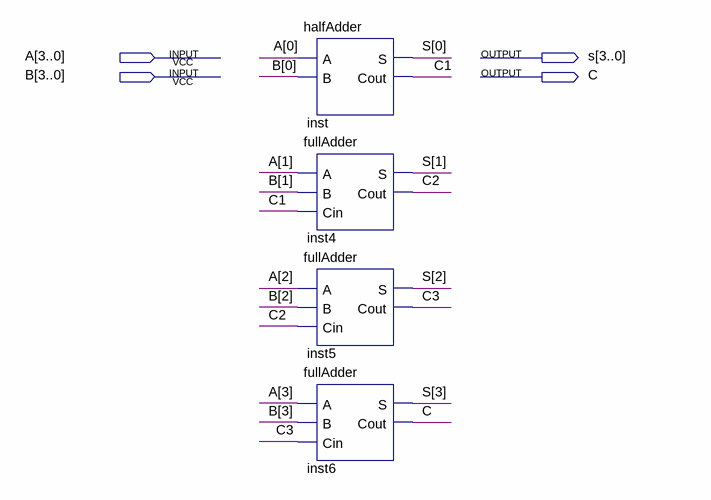
[diagram p0: schematic sheet]
// Quartus schematic RCA.bdf as structural Verilog: 4 symbols, 4 pins
module RCA (
  input  [3:0] A,
  input  [3:0] B,
  output [3:0] s,
  output C
);

  wire C1, C2, C3;

  halfAdder inst (.A(A[0]), .B(B[0]), .S(s[0]), .Cout(C1));
  fullAdder inst4 (.A(A[1]), .B(B[1]), .Cin(C1), .S(s[1]), .Cout(C2));
  fullAdder inst5 (.A(A[2]), .B(B[2]), .Cin(C2), .S(s[2]), .Cout(C3));
  fullAdder inst6 (.A(A[3]), .B(B[3]), .Cin(C3), .S(s[3]), .Cout(C));
endmodule
